# Altium schematic sheet EGS002.SchDoc
size C; SheetNumber: 2; SheetTotal: 5
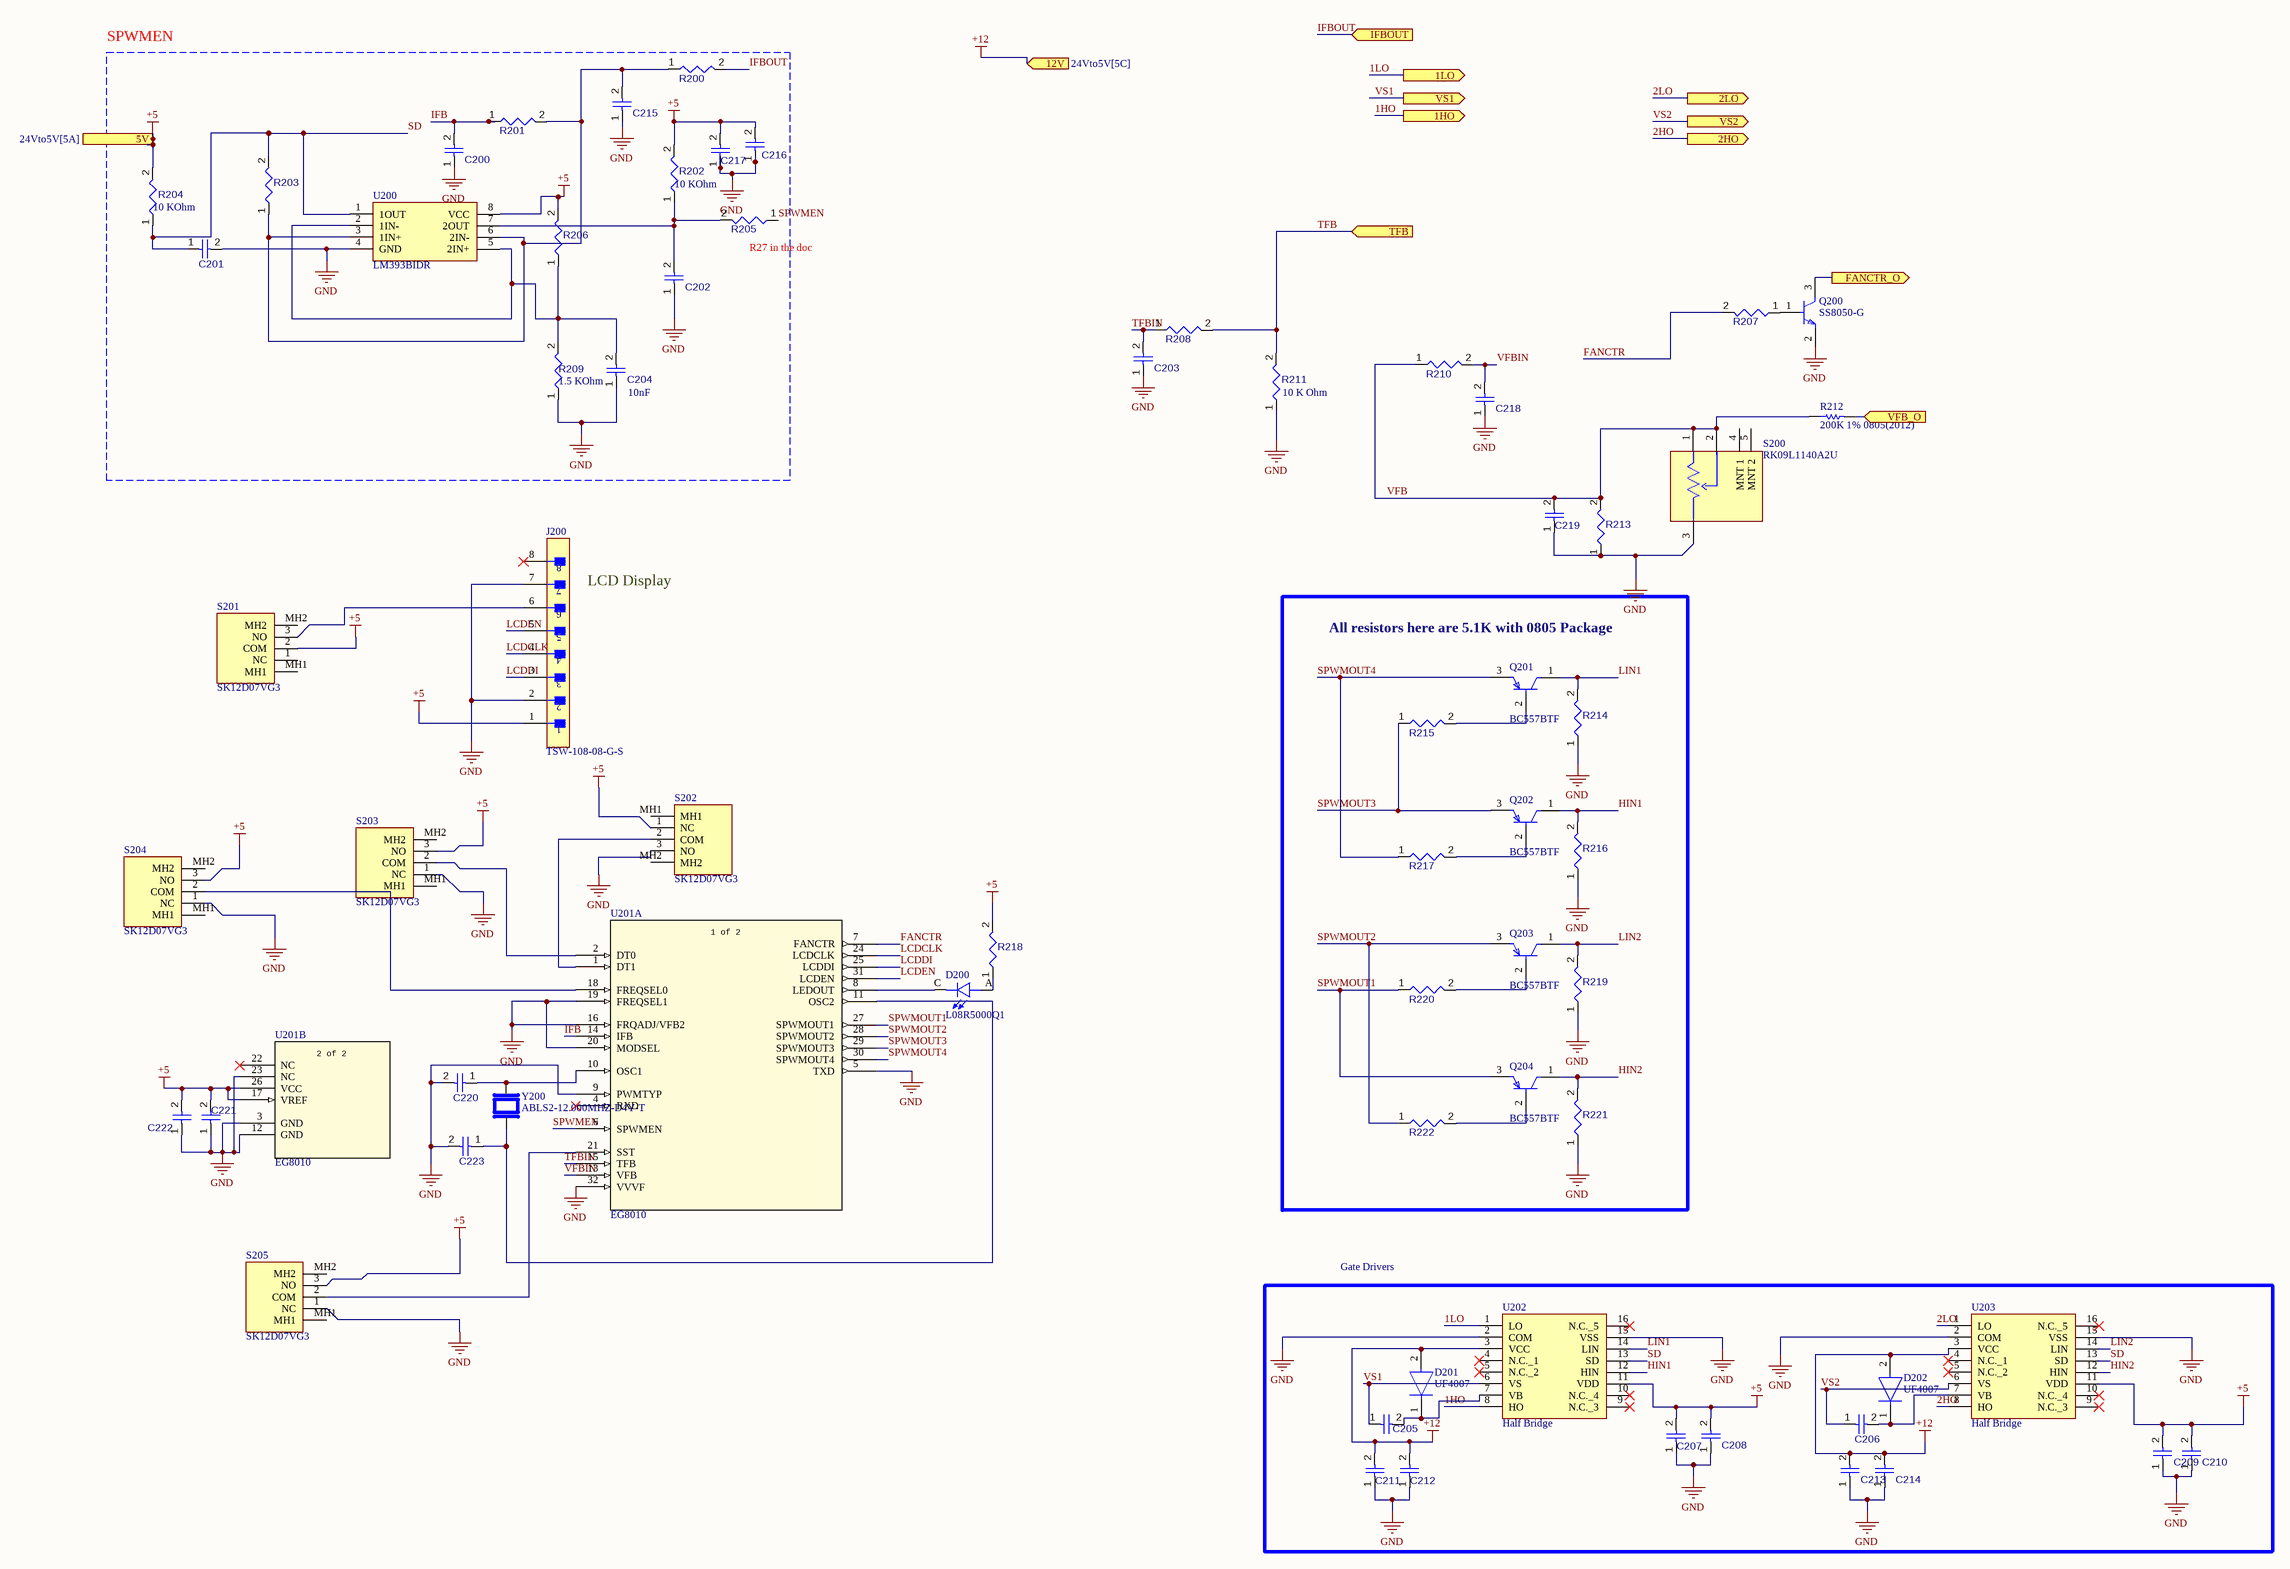
[diagram p0: EGS002.SchDoc]

## Parts
C200  Capacitor 10nF +/-20% 50V 0402  [CAPC0402(1005)60_L]  (value not drawn)
C201  Capacitor 1nF +/-20% 50V 0402  [CAPC0402(1005)33_L]  (value not drawn)
C202  Capacitor 1nF +/-20% 50V 0402  [CAPC0402(1005)33_L]  (value not drawn)
C203  Capacitor 100 nF +/-10% 50 V 0805  [CAPC2013X95X50LL10T25]  (value not drawn)
C204  Capacitor 10nF +/-20% 50V 0402  [CAPC0402(1005)60_L]  (value not drawn)
C205  Capacitor 10 uF +/- 10% 16 V 0805  [CAPC2013X135X45NL10T25]  (value not drawn)
C206  Capacitor 10 uF +/- 10% 16 V 1206  [CAPC3216X180X50NL20T25]  (value not drawn)
C207  Capacitor 100 nF +/-10% 50 V 0805  [CAPC2013X95X50LL10T25]  (value not drawn)
C208  Capacitor 10 uF +/- 10% 16 V 1206  [CAPC3216X180X50NL20T25]  (value not drawn)
C209  Capacitor 100 nF +/-10% 50 V 0805  [CAPC2013X95X50LL10T25]  (value not drawn)
C210  Capacitor 10 uF +/- 10% 16 V 1206  [CAPC3216X180X50NL20T25]  (value not drawn)
C211  Capacitor 100 nF +/-10% 50 V 0805  [CAPC2013X95X50LL10T25]  (value not drawn)
C212  Capacitor 10 uF +/- 10% 16 V 1206  [CAPC3216X180X50NL20T25]  (value not drawn)
C213  Capacitor 100 nF +/-10% 50 V 0805  [CAPC2013X95X50LL10T25]  (value not drawn)
C214  Capacitor 10 uF +/- 10% 16 V 1206  [CAPC3216X180X50NL20T25]  (value not drawn)
C215  Capacitor 1nF +/-20% 50V 0402  [CAPC0402(1005)33_L]  (value not drawn)
C216  Capacitor 10 uF +/- 10% 16 V 1206  [CAPC3216X180X50NL20T25]  (value not drawn)
C217  Capacitor 100 nF +/-10% 50 V 0805  [CAPC2013X95X50LL10T25]  (value not drawn)
C218  Capacitor 100 nF +/-10% 50 V 0805  [CAPC2013X95X50LL10T25]  (value not drawn)
C219  Capacitor 100 nF +/-10% 50 V 0805  [CAPC2013X95X50LL10T25]  (value not drawn)
C220  Capacitor 22pF +/-10% 50V 0402  [CAPC0402(1005)60_L]  (value not drawn)
C221  Capacitor 10 uF +/- 10% 16 V 1206  [CAPC3216X180X50NL20T25]  (value not drawn)
C222  Capacitor 100 nF +/-10% 50 V 0805  [CAPC2013X95X50LL10T25]  (value not drawn)
C223  Capacitor 22pF +/-10% 50V 0402  [CAPC0402(1005)60_L]  (value not drawn)
D200  L08R5000Q1  [LEDRD254W57D500H1070]
D201  UF4007  [FP-017AH-MFG]
D202  UF4007  [FP-017AH-MFG]
J200  TSW-108-08-G-S  [FP-TSW-108-08-G-S-MFG]
Q200  SS8050-G  [FP-SS8050-G-MFG]
Q201  BC557BTF  [FP-135AR-MFG]
Q202  BC557BTF  [FP-135AR-MFG]
Q203  BC557BTF  [FP-135AR-MFG]
Q204  BC557BTF  [FP-135AR-MFG]
R200  Resistor 1K +/-5% 0805 125 mW  [RESC0805(2012)_L]  (value not drawn)
R201  Resistor 100k +/-1% 0805 125 mW  [RESC2013X70X40ML20T20]  (value not drawn)
R202  Resistor 10k +/-1% 0805 125 mW  [RESC2013X50X35ML15T15]  (value not drawn)
R203  Resistor 100k +/-1% 0805 125 mW  [RESC2013X70X40ML20T20]  (value not drawn)
R204  Resistor 10k +/-1% 0805 125 mW  [RESC2013X50X35ML15T15]  (value not drawn)
R205  Resistor 1.5k +/-1% 0805 125 mW  [RESC2013X50X35ML15T15]  (value not drawn)
R206  Resistor 10k +/-1% 0805 125 mW  [RESC2013X50X35ML15T15]  (value not drawn)
R207  Resistor 1.5k +/-1% 0805 125 mW  [RESC2013X50X35ML15T15]  (value not drawn)
R208  Resistor 100R +/-1 % 0402 63 mW  [RESC0402(1005)_L]  (value not drawn)
R209  Resistor 1.5k +/-1% 0805 125 mW  [RESC2013X50X35ML15T15]  (value not drawn)
R210  Resistor 100R +/-1 % 0402 63 mW  [RESC0402(1005)_L]  (value not drawn)
R211  Resistor 10k +/-1% 0805 125 mW  [RESC2013X50X35ML15T15]  (value not drawn)
R212  200K 1% 0805(2012)  [RESC0805(2012)_N]
R213  Resistor 10k +/-1% 0805 125 mW  [RESC2013X50X35ML15T15]  (value not drawn)
R214  Resistor 5.1k +/-1% 0805 125 mW  [RESC2013X50X35ML15T15]  (value not drawn)
R215  Resistor 5.1k +/-1% 0805 125 mW  [RESC2013X50X35ML15T15]  (value not drawn)
R216  Resistor 5.1k +/-1% 0805 125 mW  [RESC2013X50X35ML15T15]  (value not drawn)
R217  Resistor 5.1k +/-1% 0805 125 mW  [RESC2013X50X35ML15T15]  (value not drawn)
R218  Resistor 1K +/-5% 0805 125 mW  [RESC0805(2012)_L]  (value not drawn)
R219  Resistor 5.1k +/-1% 0805 125 mW  [RESC2013X50X35ML15T15]  (value not drawn)
R220  Resistor 5.1k +/-1% 0805 125 mW  [RESC2013X50X35ML15T15]  (value not drawn)
R221  Resistor 5.1k +/-1% 0805 125 mW  [RESC2013X50X35ML15T15]  (value not drawn)
R222  Resistor 5.1k +/-1% 0805 125 mW  [RESC2013X50X35ML15T15]  (value not drawn)
S200  RK09L1140A2U  [FP-RK09L1140A2U-MFG]
S201  SK12D07VG3  [SK12D07VG3]
S202  SK12D07VG3  [SK12D07VG3]
S203  SK12D07VG3  [SK12D07VG3]
S204  SK12D07VG3  [SK12D07VG3]
S205  SK12D07VG3  [SK12D07VG3]
U200  LM393BIDR
U201  EG8010  (parts A,B of 2)
U202  Half Bridge  [IR2110S]
U203  Half Bridge  [IR2110S]
Y200  ABLS2-12.000MHZ-D4Y-T  [XTAL_ABLS2-12.000MHZ-D4Y-T]

## Blocks framed on the sheet
SPWMEN: C200-C202 C204 C215-C217 R200-R206 R209 U200
All resistors here are 5.1K with 0805 Package: Q201-Q204 R214-R217 R219-R222
Gate Drivers: C205-C214 D201 D202 U202 U203

## Ports
1HO (out), 1LO (out), 2HO (out), 2LO (out), 5V (see 24Vto5V[5A]), 12V (in, see 24Vto5V[5C]), FANCTR_O (out), IFBOUT (in), TFB (in), VFB_O (in), VS1 (out), VS2 (out)

## Nets
+5: C207.2 C208.2 C209.2 C210.2 C216.2 C217.2 C221.2 C222.2 J200.1 R202.2 R204.2 R206.2 R218.2 S201.2(COM) S202.1(NC) S203.3(NO) S204.3(NO) S205.3(NO) U200.8(VCC) U201.17(VREF) U201.26(VCC) U202.11(VDD) U203.11(VDD) ; port 5V
+12: C211.2 C212.2 C213.2 C214.2 D201.2(A) D202.2(A) U202.3(VCC) U203.3(VCC) ; port 12V
GND: C200.1 C201.2 C202.1 C203.1 C204.1 C207.1 C208.1 C209.1 C210.1 C211.1 C212.1 C213.1 C214.1 C215.1 C216.1 C217.1 C218.1 C219.1 C220.2 C221.1 C222.1 C223.2 J200.2 J200.7 Q200.2(E) R209.1 R211.1 R213.1 R214.1 R216.1 R219.1 R221.1 S200.3 S202.3(NO) S203.1(NC) S204.1(NC) S205.1(NC) U200.4(GND) U201.3(GND) U201.5(TXD) U201.9(PWMTYP) U201.12(GND) U201.16(FRQADJ/VFB2) U201.19(FREQSEL1) U201.20(MODSEL) U201.23(NC) U201.32(VVVF) U202.2(COM) U202.15(VSS) U203.2(COM) U203.15(VSS)
1HO: U202.8(HO) ; port 1HO
1LO: U202.1(LO) ; port 1LO
2HO: U203.8(HO) ; port 2HO
2LO: U203.1(LO) ; port 2LO
FANCTR: R207.2 U201.7(FANCTR)
FANCTR_O: Q200.3(C) ; port FANCTR_O
HIN1: Q202.1(C) R216.2 U202.12(HIN)
HIN2: Q204.1(C) R221.2 U203.12(HIN)
IFB: C200.2 R201.1 U201.14(IFB)
IFBOUT: R200.2 ; port IFBOUT
LCDCLK: J200.4 U201.24(LCDCLK)
LCDDI: J200.3 U201.25(LCDDI)
LCDEN: J200.5 U201.31(LCDEN)
LIN1: Q201.1(C) R214.2 U202.14(LIN)
LIN2: Q203.1(C) R219.2 U203.14(LIN)
SD: C201.1 R203.2 R204.1 U200.1(1OUT) U202.13(SD) U203.13(SD)
SPWMEN: R205.1 U201.6(SPWMEN)
SPWMOUT1: Q204.3(E) R220.1 U201.27(SPWMOUT1)
SPWMOUT2: Q203.3(E) R222.1 U201.28(SPWMOUT2)
SPWMOUT3: Q202.3(E) R215.1 U201.29(SPWMOUT3)
SPWMOUT4: Q201.3(E) R217.1 U201.30(SPWMOUT4)
TFB: R208.2 R211.2 ; port TFB
TFBIN: C203.2 R208.1 U201.15(TFB)
VFB: C219.2 R210.1 R212.1 R213.2 S200.1 S200.2
VFB_O: R212.2 ; port VFB_O
VFBIN: C218.2 R210.2 U201.13(VFB)
VS1: C205.1 U202.6(VS) ; port VS1
VS2: C206.1 U203.6(VS) ; port VS2
NetC202_2: C202.2 R202.1 R205.2 U200.7(2OUT)
NetC204_2: C204.2 R206.1 R209.2 U200.2(1IN-) U200.5(2IN+)
NetC205_2: C205.2 D201.1(C) U202.7(VB)
NetC206_2: C206.2 D202.1(C) U203.7(VB)
NetC215_2: C215.2 R200.1 R201.2 R203.1 U200.3(1IN+) U200.6(2IN-)
NetC220_1: C220.1 U201.10(OSC1) Y200.2
NetC223_1: C223.1 U201.11(OSC2) Y200.1
NetD200_A: D200.A R218.1
NetD200_C: D200.C U201.8(LEDOUT)
NetJ200_6: J200.6 S201.3(NO)
NetQ200_1: Q200.1(B) R207.1
NetQ201_2: Q201.2(B) R215.2
NetQ202_2: Q202.2(B) R217.2
NetQ203_2: Q203.2(B) R220.2
NetQ204_2: Q204.2(B) R222.2
NetS202_2: S202.2(COM) U201.1(DT1)
NetS203_2: S203.2(COM) U201.2(DT0)
NetS204_2: S204.2(COM) U201.18(FREQSEL0)
NetS205_2: S205.2(COM) U201.21(SST)

Not connected (* = marked no-connect by the designer): J200 8*; S200 4(MNT_1) 5(MNT_2); S201 1(NC) MH1 MH2; S202 MH1 MH2; S203 MH1 MH2; S204 MH1 MH2; S205 MH1 MH2; U201 4(RXD)* 22(NC)*; U202 4(N.C._1)* 5(N.C._2)* 9(N.C._3)* 10(N.C._4)* 16(N.C._5)*; U203 4(N.C._1)* 5(N.C._2)* 9(N.C._3)* 10(N.C._4)* 16(N.C._5)*

## Notes on the sheet
- (near R202) 10 KOhm
- (near R204) 10 KOhm
- (near R205) R27 in the doc
- (near R209) 1.5 KOhm
- (near C204) 10nF
- (near R211) 10 K Ohm
- (near J200) LCD Display
- (in symbol EG8010, part A) 1 of 2
- (in symbol EG8010, part B) 2 of 2

## Library data of the parts
C200 C204 = CMP-001-00069-3: Chip Capacitor, 10nF +/-20%, 50V, 0402, Thickness 0.6 mm; Tolerance: 5%; Mounting Technology: SMT; Case/Package: 0402; Pins: 2; Min Operating Temperature: -55°C; Max Operating Temperature: 85°C; Voltage Rating: 50V; Value: 10nF
C201 C202 C215 = CMP-001-00066-3: Chip Capacitor, 1nF +/-20%, 50V, 0402, Thickness 0.33 mm; Tolerance: 10%; Mounting Technology: SMT; Case/Package: 0402; Pins: 2; Min Operating Temperature: -55°C; Max Operating Temperature: 85°C; Voltage Rating: 50V; Value: 1nF
C203 C207 C209 C211 C213 C217-C219 C222 = CMP-001-00018-6: Chip Capacitor, 100 nF, +/- 10%, 50 V, 0805 (2012 Metric); Capacitor Type: Ceramic; Voltage Rating: 50V; Value: 100nF; Mounting Technology: SM; Case/Package: 0805; Pins: 2; RoHS Compliant: True; Min Operating Temperature: -55°C; Max Operating Temperature: 125°C; Tolerance: 10%
C205 = CMP-001-00015-6: Chip Capacitor, 10 uF, +/- 10%, 16 V, 0805 (2012 Metric); Capacitor Type: Ceramic; Voltage Rating: 16V; Value: 10µF; Mounting Technology: SM; Case/Package: 0805; Pins: 2; RoHS Compliant: True; Min Operating Temperature: -55°C; Max Operating Temperature: 85°C; Tolerance: 10%
C206 C208 C210 C212 C214 C216 C221 = CMP-001-00016-6: Chip Capacitor, 10 uF, +/- 10%, 16 V, 1206 (3216 Metric); Capacitor Type: Ceramic; Voltage Rating: 16V; Value: 10µF; Mounting Technology: SM; Case/Package: 1206; Pins: 2; RoHS Compliant: True; Min Operating Temperature: -55°C; Max Operating Temperature: 125°C; Tolerance: 10%
C220 C223 = CMP-001-00073-3: Chip Capacitor, 22pF +/-10%, 50V, 0402, Thickness 0.6 mm; Tolerance: 10%; Mounting Technology: SMT; Case/Package: 0402; Pins: 2; Min Operating Temperature: -55°C; Max Operating Temperature: 85°C; Voltage Rating: 50V; Value: 22pF
D200 = L08R5000Q1: LED, 5MM, ORANGE; LED / Lamp Size: 5mm / T-1 3/4; LED Colour: Orange; Typ Luminous Intensity: 4.3mcd; Viewing Angle: ...; MF: LED Technology; Value: *; SnapEDA_Link: https://www.snapeda.com/parts/L08R5000Q1/LED+Technology/view-part/?ref=snap; MP: L08R5000Q1; Check_prices: https://www.snapeda.com/parts/L08R5000Q1/LED+Technology/view-part/?ref=eda; Availability: In Stock; Price: None; Package: None
D201 D202 = CMP-2000-05028-2: DIODE GEN PURP 1KV 1A DO41; Manufacturer: ON Semiconductor; Capacitance: 17pF; Max Surge Forward Current: 30A; Max Repetitive Reverse Voltage: 1000V; Value: 17pF; Max Junction Temp: +150°C; Peak Reverse Current: 10uA; Temperature: -65°C to +150°C; ComponentLink2Description: Datasheet; Digikey Description: DIODE GEN PURP 1KV 1A DO41; Temperature Range High: +150°C; Height: 2.72mm; Category: Diode; Automotive: No; Package: 017AH; Device Class L1: Discrete Semiconductors; ComponentLink2URL: https://www.onsemi.com/pub/Collateral/UF4007-D.pdf; Device Class L3: Rectifier Diodes; Mouser Description: Rectifiers 1000V 1a Rectifier Glass Passivated; Temperature Range Low: -65°C; Octopart: https://octopart.com/uf4007-on+semiconductor-84331693; Manufacturer Part Number: UF4007; Forward Current: 1A; Device Class L2: Diodes; Lead Free: Yes; Footprint Url: https://www.onsemi.com/pub/Collateral/017AH.PDF; RoHS: TRUE
J200 = CMP-02766-000001-1: CONN HEADER VERT 8POS 2.54MM; Manufacturer: Samtec; Number Of Contacts: 8; Conn Orientation: Straight; Conn Gender: Male; Device Class L1: Connectors; ComponentLink2Description: Datasheet; Digikey Description: CONN HEADER VERT 8POS 2.54MM; ComponentLink2URL: http://suddendocs.samtec.com/catalog_english/tsw_th.pdf; Temperature: -55°C to +125°C; RoHS: TRUE; Mouser Description: TSW - Samtec 2.54mm Pin Header 13.46mm Overall Pin Length 5.08mm Tail; Automotive: No; Temperature Range High: +125°C; Package: TSW-108-08-G-S; Device Class L3: unset; Manufacturer Part Number: TSW-108-08-G-S; Pitch: 2.54mm; Number Of Rows: 1; Lead Free: Yes; Height: 8.71mm; Contact Material: Gold,Nickel; Footprint Url: http://suddendocs.samtec.com/prints/tsw-xxx-xx-x-x-xx-xxx-footprint.pdf; Temperature Range Low: -55°C; Octopart: https://octopart.com/tsw-108-08-g-s-samtec-272653; Category: Conn; Device Class L2: Headers and Wire Housings
Q200 = CMP-20235-000001-1: NPN TRANSISTOR 1.5A 40V SOT-23 R; Transition Frequency: 100MHz; Max Breakdown Voltage: 25V; Collector Emitter Voltage (VCEO): 400mV; Max Power Dissipation: 300mW; Max Collector Current: 1.5A; Case/Package: TO-236-3; Packaging: Tape and Reel; RoHS Compliant: Yes; Mount: Surface Mount; Collector Emitter Breakdown Voltage: 25V
Q201-Q204 = CMP-00278-84408945-1: BC557BTF Small Signal Bipolar Transistor, 0.1A I(C), 45V V(BR)CEO, 1-Element, PNP, Silicon, TO-92; Manufacturer Lifecycle Status: ACTIVE; Max Power Dissipation: 500mW; Frequency: 150MHz; hFE Min: 110; Number of Elements: 1; Current Rating: -100mA; Collector Emitter Saturation Voltage: -250mV; Max Collector Current: 100mA; Emitter Base Voltage (VEBO): -5V; Voltage Rating (DC): -45V; Element Configuration: Single; Max Frequency: 10MHz; Collector Base Voltage (VCBO): -50V; Collector Emitter Voltage (VCEO): 45V; Contact Plating: Tin; Min Operating Temperature: -65°C; RoHS: Compliant; Max Operating Temperature: 150°C; Weight: 240mg; Power Dissipation: 500mW; Lifecycle Status: Production; Case/Package: TO-92; Collector Emitter Breakdown Voltage: 45V; Length: 5.2mm; Schedule B: 8541210080, 8541210080; Lead Free: Lead Free; Polarity: PNP; REACH SVHC: No SVHC; Mount: Through Hole; NexarPartId: 84408945; Max Breakdown Voltage: 45V; Transition Frequency: 150MHz; Height: 5.33mm; Number of Pins: 3; Gain Bandwidth Product: 150MHz; Width: 4.19mm
R200 R218 = CMP-009-00118-3: Chip Resistor, 1 kOhms, +/-5%, 125 mW, -55 to 155 degC, 0805; Tolerance: 5%; Power: 125mW; Case/Package: 0805; Pins: 2; Min Operating Temperature: -55°C; Max Operating Temperature: 155°C; Value: 1k
R201 R203 = CMP-009-00024-5: Chip Resistor, 100 KOhm, +/- 1%, 0.125 W, -55 to 155 degC, 0805 (2012 Metric); Power: 125mW; Voltage Rating: 150V; Mounting Technology: SM; Case/Package: 0805; Pins: 2; RoHS Compliant: True; Min Operating Temperature: -55°C; Max Operating Temperature: 155°C; Tolerance: 1%; Value: 100k
R202 R204 R206 R211 R213 = CMP-009-00018-5: Chip Resistor, 10 KOhm, +/- 1%, 125 mW, -55 to 155 degC, 0805 (2012 Metric); Power: 125mW; Voltage Rating: 150V; Mounting Technology: SM; Case/Package: 0805; Pins: 2; RoHS Compliant: True; Min Operating Temperature: -55°C; Max Operating Temperature: 155°C; Tolerance: 1%; Value: 10k
R205 R207 R209 = CMP-009-00018-5: Chip Resistor, 1.5 KOhm, +/- 1%, 125 mW, -55 to 155 degC, 0805 (2012 Metric); Power: 125mW; Voltage Rating: 150V; Value: 10k; Mounting Technology: SM; Case/Package: 0805; Pins: 2; RoHS Compliant: True; Min Operating Temperature: -55°C; Max Operating Temperature: 155°C; Tolerance: 1%
R208 R210 = CMP-009-00167-3: Chip Resistor, 100 Ohms, +/-1 %, 63 mW, -55 to 155 degC, 0402; Tolerance: 1%; Power: 63mW; Value: 100; Case/Package: 0402; Pins: 2; Min Operating Temperature: -55°C; Max Operating Temperature: 155°C
R212 = CMP-1013-00768-1: 200K 0.125W 1% 0805 (2012 Metric)  SMD; Case-Metric: 2012; Value: 200000.00 Ohm; Case-EIA: 0805; Power: 0.125 W; Technology: SMT; Tolerance: 1 %
R214-R217 R219-R222 = CMP-009-00018-5: Chip Resistor, 5.1 KOhm, +/- 1%, 125 mW, -55 to 155 degC, 0805 (2012 Metric); Power: 125mW; Voltage Rating: 150V; Value: 10k; Mounting Technology: SM; Case/Package: 0805; Pins: 2; RoHS Compliant: True; Min Operating Temperature: -55°C; Max Operating Temperature: 155°C; Tolerance: 1%
S200 = CMP-24118-000002-1: 9mm Size Metal Shaft Snap-in Type RK09L Series; Manufacturer: ALPS; Tolerance: 20%; Resistance: 10kΩ; Standoff Height: 2.55mm; Value: 10kΩ; Power Rating: 0.05W; Voltage Rating: 50V; Lead Free: Yes; Temperature: -10°C to +70°C; Device Class L1: Passive Components; ComponentLink2Description: Datasheet; Octopart: https://octopart.com/rk09l1140a2u-alps-7850070; Device Class L2: Resistors; Package: RK09L1140A2U; Height: 30mm; Category: Res; Temperature Range High: +70°C; Temperature Range Low: -10°C; RoHS: TRUE; Manufacturer Part Number: RK09L1140A2U; Series: RK09L; Automotive: No; ComponentLink2URL: https://www.alps.com/prod/info/E/HTML/Potentiometer/RotaryPotentiometers/RK09L/RK09L1140A2U.html; Device Class L3: Variable Resistors and Potentiometers
S201-S205 = SK12D07VG3: Switch; Manufacturer_Name: Shou Han; Datasheet Link: https://datasheet.lcsc.com/lcsc/1912111437_SHOU-HAN-SK12D07VG3_C431547.pdf; Height: 4.9mm; Manufacturer_Part_Number: SK12D07VG3
U200 = LM393BIDR: Analog Comparators Dual standard comparator 8-SOIC -40 to 85; Manufacturer_Name: Texas Instruments; Geometry.Height: 1.75mm; Manufacturer_Part_Number: LM393BIDR; Mouser Part Number: 595-LM393BIDR; Mouser Price/Stock: https://www.mouser.co.uk/ProductDetail/Texas-Instruments/LM393BIDR?qs=BJlw7L4Cy78N8CV%252BGpRosA%3D%3D; Arrow Part Number: LM393BIDR; Arrow Price/Stock: https://www.arrow.com/en/products/lm393bidr/texas-instruments?utm_currency=USD&region=nac; Datasheet Link: https://www.ti.com/lit/gpn/LM393B
U201 = EG8010: Description; Manufacturer_Name: EG; Copyright: Copyright (C) 2026 Ultra Librarian. All rights reserved.; Manufacturer_Part_Number: EG8010; RefDes: RefDes; Type: Type
U202 U203 = IR2110S
Y200 = ABLS2-12.000MHZ-D4Y-T: HC/49US (AT49) LOW PROFILE SURFACE MOUNT MICROPROCESSOR CRYSTAL; MF: Abracon; Purchase-URL: https://pricing.snapeda.com/search/part/ABLS2-12.000MHZ-D4Y-T/?ref=eda; Package: HC49/US Abracon; MP: ABLS2-12.000MHZ-D4Y-T; Value: *; Price: None; Availability: In Stock; SnapEDA_Link: https://www.snapeda.com/parts/ABLS2-12.000MHZ-D4Y-T/Abracon+LLC/view-part/?ref=snap; Check_prices: https://www.snapeda.com/parts/ABLS2-12.000MHZ-D4Y-T/Abracon+LLC/view-part/?ref=eda